# Altium schematic sheet KeypadDisplayConnectors.SchDoc
size Letter
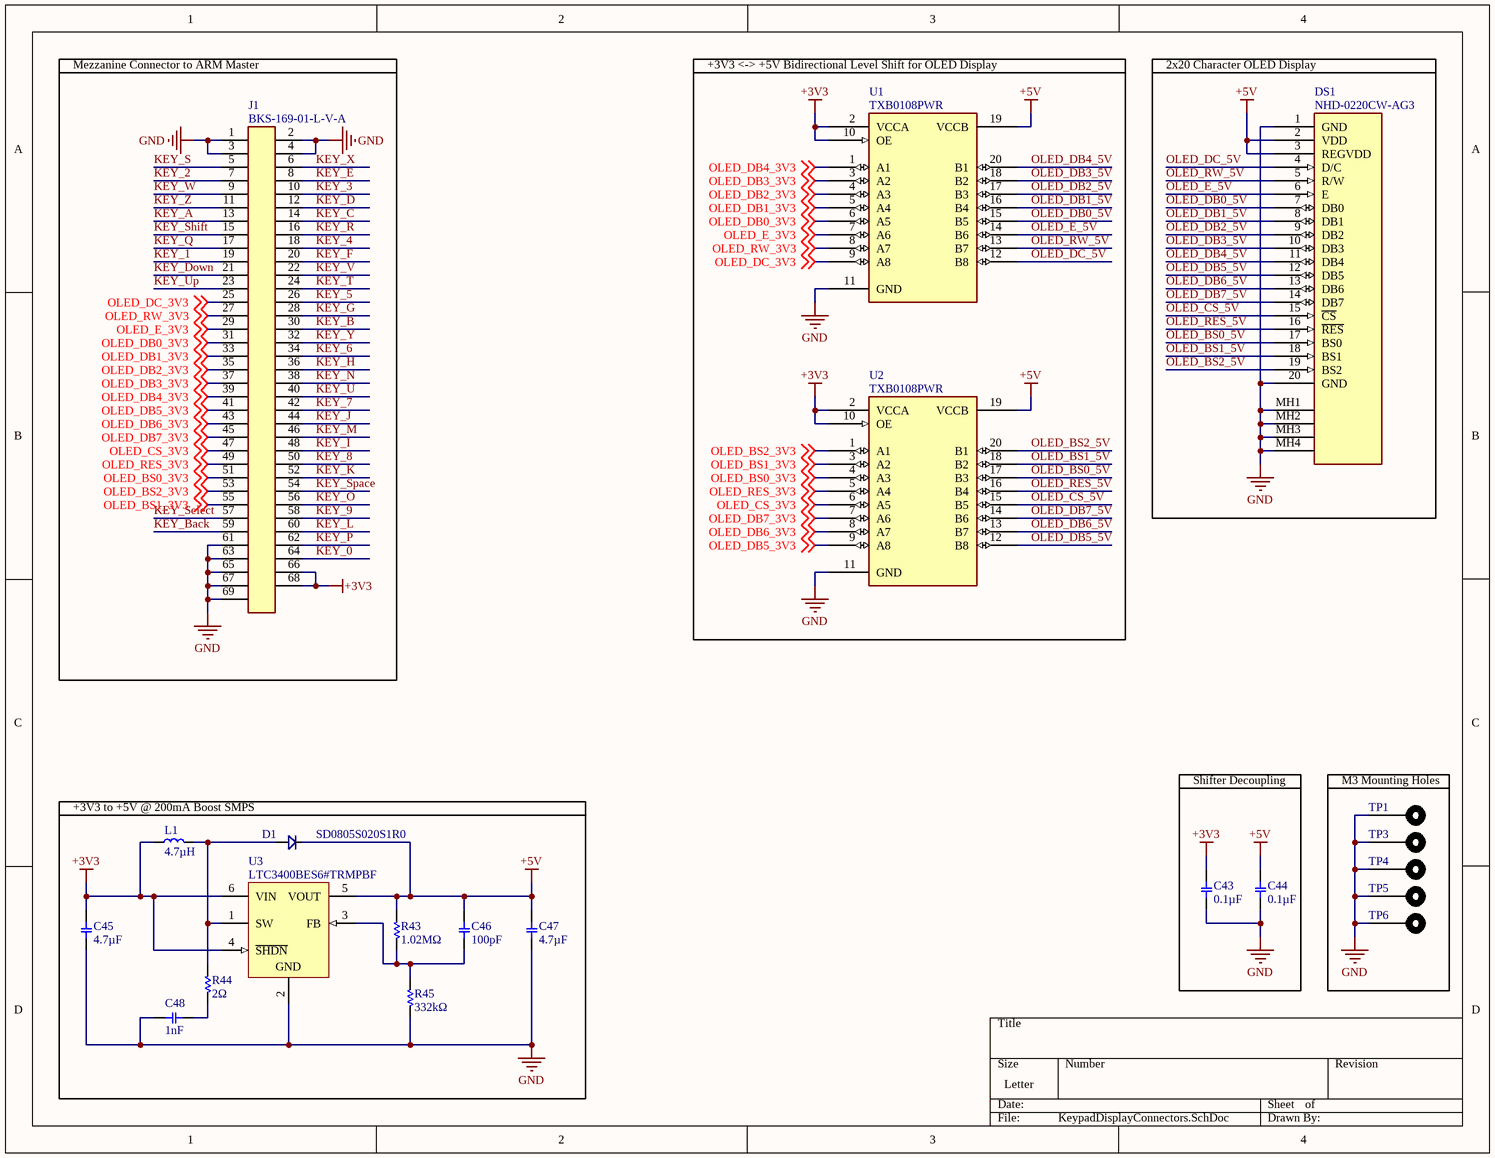
[diagram p0: KeypadDisplayConnectors.SchDoc]

## Parts
C43  0.1µF  [C0805(2012)_NP_med]
C44  0.1µF  [C0805(2012)_NP_med]
C45  4.7µF  [C0805(2012)_NP_med]
C46  100pF  [C0805(2012)_NP_med]
C47  4.7µF  [C0805(2012)_NP_med]
C48  1nF  [C0805(2012)_NP_med]
D1  SD0805S020S1R0  [C0805(2012)_P_med]
DS1  NHD-0220CW-AG3  [Newhaven NHD-0220CW-AG3]
J1  BKS-169-01-L-V-A  [SAMTEC BKS-169-01-L-V-A]
L1  4.7µH  [C0805(2012)_NP_med]
R43  1.02MΩ  [R0805(2012)_med]
R44  2Ω  [R0805(2012)_med]
R45  332kΩ  [R0805(2012)_med]
TP1  Testpoint  [M3x0.5 Hole]  (value not drawn)
TP3  Testpoint  [M3x0.5 Hole]  (value not drawn)
TP4  Testpoint  [M3x0.5 Hole]  (value not drawn)
TP5  Testpoint  [M3x0.5 Hole]  (value not drawn)
TP6  Testpoint  [M3x0.5 Hole]  (value not drawn)
U1  TXB0108PWR  [TI 20 Pin PW (R-PDSO-G20)]
U2  TXB0108PWR  [TI 20 Pin PW (R-PDSO-G20)]
U3  LTC3400BES6#TRMPBF  [LT-S6-6-TSOT-23_N]

## Blocks framed on the sheet
+3V3 <-> +5V Bidirectional Level Shift for OLED Display: U1 U2
2x20 Character OLED Display: DS1
Shifter Decoupling: C43 C44
M3 Mounting Holes: TP1 TP3-TP6
+3V3 to +5V @ 200mA Boost SMPS: C45-C48 D1 L1 R43-R45 U3

## Nets
+3V3: C43.1 C45.1 J1.66 J1.68 L1.1 U1.2(VCCA) U1.10(OE) U2.2(VCCA) U2.10(OE) U3.4(~{SHDN}) U3.6(VIN)
+5V: C44.1 C46.1 C47.1 D1.1(K) DS1.2(VDD) DS1.3(REGVDD) R43.1 U1.19(VCCB) U2.19(VCCB) U3.5(VOUT)
GND: C43.2 C44.2 C45.2 C47.2 C48.1 DS1.1(GND) DS1.20(GND) DS1.MH1 DS1.MH2 DS1.MH3 DS1.MH4 J1.1 J1.2 J1.3 J1.4 J1.61 J1.63 J1.65 J1.67 J1.69 R45.2 TP1.1 TP3.1 TP4.1 TP5.1 TP6.1 U1.11(GND) U2.11(GND) U3.2(GND)
KEY_0: J1.64
KEY_1: J1.19
KEY_2: J1.7
KEY_3: J1.10
KEY_4: J1.18
KEY_5: J1.26
KEY_6: J1.34
KEY_7: J1.42
KEY_8: J1.50
KEY_9: J1.58
KEY_A: J1.13
KEY_B: J1.30
KEY_Back: J1.59
KEY_C: J1.14
KEY_D: J1.12
KEY_Down: J1.21
KEY_E: J1.8
KEY_F: J1.20
KEY_G: J1.28
KEY_H: J1.36
KEY_I: J1.48
KEY_J: J1.44
KEY_K: J1.52
KEY_L: J1.60
KEY_M: J1.46
KEY_N: J1.38
KEY_O: J1.56
KEY_P: J1.62
KEY_Q: J1.17
KEY_R: J1.16
KEY_S: J1.5
KEY_Select: J1.57
KEY_Shift: J1.15
KEY_Space: J1.54
KEY_T: J1.24
KEY_U: J1.40
KEY_Up: J1.23
KEY_V: J1.22
KEY_W: J1.9
KEY_X: J1.6
KEY_Y: J1.32
KEY_Z: J1.11
OLED_BS0_3V3: J1.51 U2.4(A3) ; off-sheet OLED_BS0_3V3
OLED_BS0_5V: DS1.17(BS0) U2.17(B3)
OLED_BS1_3V3: J1.55 U2.3(A2) ; off-sheet OLED_BS1_3V3
OLED_BS1_5V: DS1.18(BS1) U2.18(B2)
OLED_BS2_3V3: J1.53 U2.1(A1) ; off-sheet OLED_BS2_3V3
OLED_BS2_5V: DS1.19(BS2) U2.20(B1)
OLED_CS_3V3: J1.47 U2.6(A5) ; off-sheet OLED_CS_3V3
OLED_CS_5V: DS1.15(~{CS}) U2.15(B5)
OLED_DB0_3V3: J1.31 U1.6(A5) ; off-sheet OLED_DB0_3V3
OLED_DB0_5V: DS1.7(DB0) U1.15(B5)
OLED_DB1_3V3: J1.33 U1.5(A4) ; off-sheet OLED_DB1_3V3
OLED_DB1_5V: DS1.8(DB1) U1.16(B4)
OLED_DB2_3V3: J1.35 U1.4(A3) ; off-sheet OLED_DB2_3V3
OLED_DB2_5V: DS1.9(DB2) U1.17(B3)
OLED_DB3_3V3: J1.37 U1.3(A2) ; off-sheet OLED_DB3_3V3
OLED_DB3_5V: DS1.10(DB3) U1.18(B2)
OLED_DB4_3V3: J1.39 U1.1(A1) ; off-sheet OLED_DB4_3V3
OLED_DB4_5V: DS1.11(DB4) U1.20(B1)
OLED_DB5_3V3: J1.41 U2.9(A8) ; off-sheet OLED_DB5_3V3
OLED_DB5_5V: DS1.12(DB5) U2.12(B8)
OLED_DB6_3V3: J1.43 U2.8(A7) ; off-sheet OLED_DB6_3V3
OLED_DB6_5V: DS1.13(DB6) U2.13(B7)
OLED_DB7_3V3: J1.45 U2.7(A6) ; off-sheet OLED_DB7_3V3
OLED_DB7_5V: DS1.14(DB7) U2.14(B6)
OLED_DC_3V3: J1.25 U1.9(A8) ; off-sheet OLED_DC_3V3
OLED_DC_5V: DS1.4(D/C) U1.12(B8)
OLED_E_3V3: J1.29 U1.7(A6) ; off-sheet OLED_E_3V3
OLED_E_5V: DS1.6(E) U1.14(B6)
OLED_RES_3V3: J1.49 U2.5(A4) ; off-sheet OLED_RES_3V3
OLED_RES_5V: DS1.16(~{RES}) U2.16(B4)
OLED_RW_3V3: J1.27 U1.8(A7) ; off-sheet OLED_RW_3V3
OLED_RW_5V: DS1.5(R/W) U1.13(B7)
NetC46_2: C46.2 R43.2 R45.1 U3.3(FB)
NetC48_2: C48.2 R44.2
NetD1_2: D1.2(A) L1.2 R44.1 U3.1(SW)

## Notes on the sheet
- Mezzanine Connector to ARM Master

## Library data of the parts
C43 C44 C46 C48 = CPN_SMT: SMT Capacitor; Tolerance: X7R; Rating: 16v
  C43 C44: Value: 0.1µF
  C46: Value: 100pF
  C48: Value: 1nF
C45 C47 = CPN_SMT: SMT Capacitor; Manufacturer: Taiyo Yuden; Part Number: JMK212BJ475MG; Tolerance: X7R; Rating: 16v; Digikey #: 587-2717-1-ND; Value: 4.7µF
D1 = DIODE_sMT: SMT LED; Manufacturer: AVX; Part Number: SD0805S020S1R0; Digikey #: 478-7800-1-ND
DS1 = NewHaven NHD-0220CW-AG3: Slim Character OLED. 2 lines x 20 character Green OLED display. 2.8V or 5V power. 4/8-bit Parallel, SPI, or I2C MPU interface. 3 built-in font tables. Double height characters.; Manufacturer: Newhaven Display Intl; Number of Characters: 40; Display Format: 20 x 2; Character Format: 5 x 8 Dots; Display Mode: Passive; Character Size: 5.57mm H x 3.22mm W; Outline L x W x H: 92.00mm x 23.30mm x 2.50mm; Viewing Area: 77.92mm L x 16.28mm W; Voltage - Supply: 2.4 V ~ 5.5 V; Dot Size: 0.62mm W x 0.67mm H; Interface: Parallel, 8-Bit, I²C, SPI; Background Color: Black; Supplier 1: Digi-Key; Manufacturer Part Number: NHD-0220CW-AG3; RoHS: RoHS Compliant; Category: Optoelectronics; Stock 1: 82; Pricing 1: 1=27.5, 5=25.85, 10=24.2, 50=22.83, 100=21.73, 250=20.62996, 500=19.8 (USD); Display Type: OLED; Backlight: -; Operating Temperature: -40°C ~ 85°C; Text Color: Green; ComponentLink1URL: http://www.newhavendisplay.com/specs/NHD-0220CW-AG3.pdf; ComponentLink1Description: http://www.newhavendisplay.com/specs/NHD-0220CW-AG3.pdf; Supplier Part Number 1: NHD-0220CW-AG3-ND
J1 = Samtec BKS-169-01-L-V-A: CONN HDR 69POS 1MM SMD GLD
L1 = IND_SMT: SMT Inductor; Manufacturer: Murata; Part Number: LQM2MPN4R7MG0L; Tolerance: 5%; Rating: 700mA; Digikey #: 490-12073-1-ND; Value: 4.7µH
R43-R45 = RES_SMT: SMT resistor; Tolerance: 1%
  R43: Value: 1.02MΩ
  R44: Value: 2Ω
  R45: Value: 332kΩ
U1 U2 = TI TXB0108PWR: IC 8-BIT TRNSTR 15KV ESD 20TSSOP; Manufacturer: Texas Instruments; Translator Type: Voltage Level; Channel Type: Bidirectional; Number of Circuits: 1; Channels per Circuit: 8; Voltage - VCCA: 1.2 V ~ 3.6 V; Voltage - VCCB: 1.65 V ~ 5.5 V; Output Type: Tri-State, Non-Inverted; Data Rate: 100Mbps; Supplier 1: Digi-Key; Manufacturer Part Number: TXB0108PWR; RoHS: RoHS Compliant; Category: Integrated Circuits (ICs); Stock 1: 25140; Pricing 1: 1=1.88, 10=1.693, 100=1.3578, 500=1.116, 1000=0.775 (USD); Packaging: Cut Tape (CT); Input Signal: -; Output Signal: -; Operating Temperature: -40°C ~ 85°C (TA); Features: Auto-Direction Sensing; Mounting Type: Surface Mount; Package / Case: 20-TSSOP (0.173", 4.40mm Width); Supplier Device Package: 20-TSSOP; ComponentLink1URL: http://www.ti.com/lit/ds/symlink/txb0108.pdf; ComponentLink1Description: http://www.ti.com/lit/ds/symlink/txb0108.pdf
U3 = LTC3400BES6#TRMPBF: 600 mA, 1.2 MHz Micropower Synchronous Boost Converter, 6-pin SOT23 (S6-6), -30 to 85 degC, Pb-Free, Mini Tape and Reel; Manufacturer: Linear Technology; Number of Outputs: 1; DatasheetVersion: Rev. A; PackageVersion: Jun-10; PackageReference: S6-6; PackageDescription: 6-Pin Plastic TSOT-23, Body 2.9 x 1.63 mm, Pitch 0.95 mm; Supplier 1: Digi-Key; Supplier Part Number 1: LTC3400BES6#TRMPBFTR-ND; Supplier 2: Digi-Key; Supplier Part Number 2: LTC3400BES6#TRMPBFCT-ND; Supplier 3: Digi-Key; Supplier Part Number 3: LTC3400BES6#TRMPBFDKR-ND; Supplier 4: Newark; Supplier Part Number 4: 56M7484; Packing: Mini Tape and Reel; RoHS: TRUE; Mounting Technology: Surface Mount; Code_JEDEC: MO-193; PartNumber: LTC3400BES6#TRMPBF; ComponentLink1Description: Manufacturer URL; ComponentLink1URL: http://www.linear.com/; ComponentLink2Description: Datasheet; ComponentLink2URL: http://cds.linear.com/docs/en/datasheet/3400fa.pdf; ComponentLink3Description: Package Specification; ComponentLink3URL: http://cds.linear.com/docs/en/packaging/SOT_6_05-08-1636.pdf